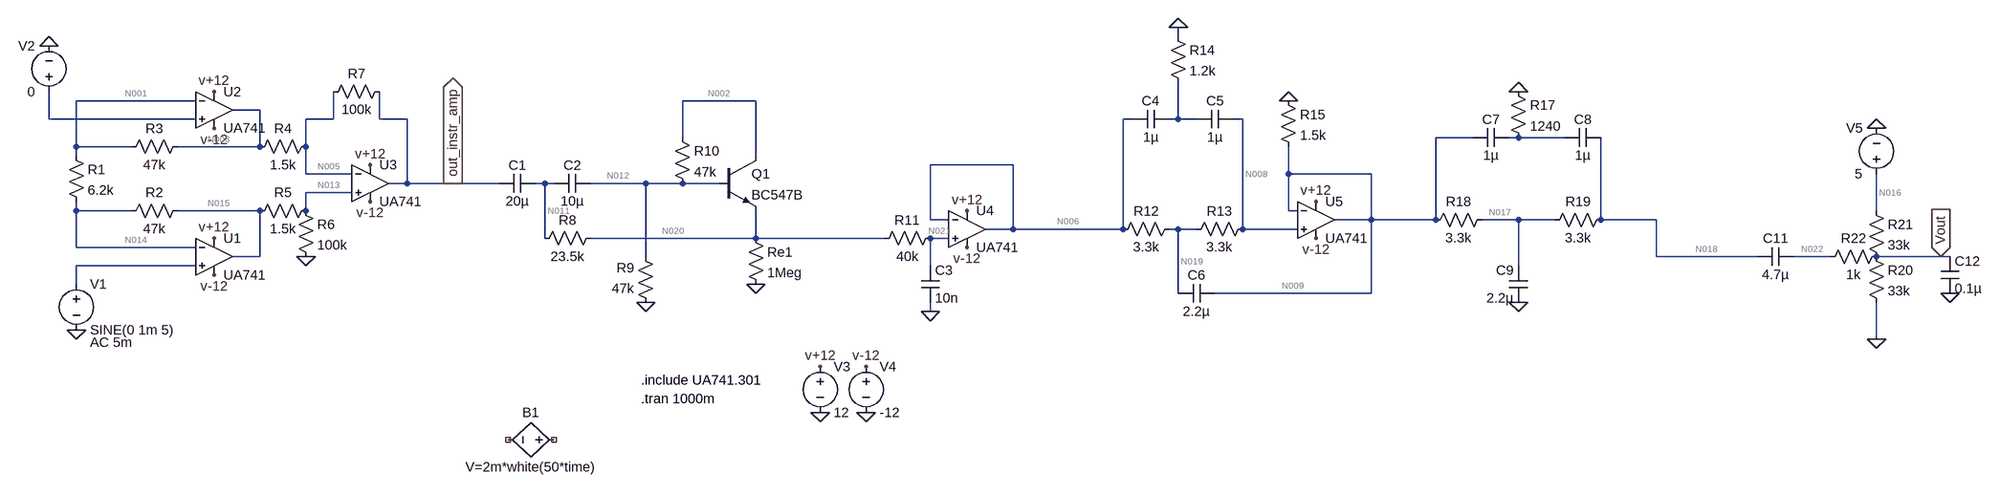
[diagram p0: schematic ECG.asc]
ECG.asc, the LTspice schematic file:
Version 4
SHEET 1 3316 1264
WIRE 1840 64 1840 48
WIRE 128 176 -80 176
WIRE 1104 176 976 176
WIRE 240 192 192 192
WIRE -128 208 -128 160
WIRE 128 208 -128 208
WIRE 368 208 368 160
WIRE 368 208 320 208
WIRE 448 208 448 160
WIRE 496 208 448 208
WIRE 1760 208 1744 208
WIRE 1840 208 1840 144
WIRE 1840 208 1824 208
WIRE 1872 208 1840 208
WIRE 1952 208 1936 208
WIRE 976 240 976 176
WIRE 2416 240 2352 240
WIRE 2496 240 2480 240
WIRE 2576 240 2496 240
WIRE -80 256 -80 176
WIRE 16 256 -80 256
WIRE 240 256 240 192
WIRE 240 256 96 256
WIRE 320 256 320 208
WIRE -80 272 -80 256
WIRE 1104 272 1104 176
WIRE 1552 288 1408 288
WIRE 320 304 320 256
WIRE 400 304 320 304
WIRE 2032 304 2032 256
WIRE 2176 304 2032 304
WIRE 496 320 496 208
WIRE 496 320 464 320
WIRE 576 320 496 320
WIRE 656 320 576 320
WIRE 736 320 720 320
WIRE 752 320 736 320
WIRE 912 320 816 320
WIRE 976 320 912 320
WIRE 1040 320 976 320
WIRE 400 336 320 336
WIRE -80 368 -80 352
WIRE 16 368 -80 368
WIRE 240 368 96 368
WIRE 320 368 320 336
WIRE 2032 368 2032 304
WIRE 2048 368 2032 368
WIRE 3120 368 3120 304
WIRE 1408 384 1408 288
WIRE 1440 384 1408 384
WIRE 2176 384 2176 304
WIRE 2176 384 2112 384
WIRE 2352 384 2352 240
WIRE 2352 384 2176 384
WIRE 2496 384 2432 384
WIRE 2560 384 2496 384
WIRE 2640 384 2640 240
WIRE 2736 384 2640 384
WIRE 1552 400 1552 288
WIRE 1552 400 1504 400
WIRE 1744 400 1744 208
WIRE 1744 400 1552 400
WIRE 1840 400 1824 400
WIRE 1872 400 1840 400
WIRE 1952 400 1952 208
WIRE 2048 400 1952 400
WIRE 736 416 736 320
WIRE 1104 416 1104 368
WIRE 1104 416 816 416
WIRE 1328 416 1104 416
WIRE 1440 416 1408 416
WIRE -80 432 -80 368
WIRE 128 432 -80 432
WIRE 240 448 240 368
WIRE 240 448 192 448
WIRE 912 448 912 320
WIRE 2736 448 2736 384
WIRE 2912 448 2736 448
WIRE 3040 448 2976 448
WIRE 3232 448 3120 448
WIRE 3248 448 3232 448
WIRE 128 464 -80 464
WIRE 1408 464 1408 416
WIRE 2496 464 2496 384
WIRE -80 496 -80 464
WIRE 1840 512 1840 400
WIRE 2176 512 2176 384
WIRE 2176 512 1904 512
WIRE 1408 544 1408 528
WIRE 3120 592 3120 528
FLAG -80 576 0
FLAG -128 80 0
FLAG 320 448 0
FLAG 912 528 0
FLAG 1104 496 0
FLAG 1408 544 0
FLAG 1840 48 0
FLAG 2032 176 0
FLAG 2496 160 0
FLAG 2496 528 0
FLAG 1216 720 0
FLAG 1296 720 0
FLAG 1216 640 v+12
FLAG 1296 640 v-12
FLAG 160 416 v+12
FLAG 160 160 v+12
FLAG 432 288 v+12
FLAG 1472 368 v+12
FLAG 2080 352 v+12
FLAG 160 480 v-12
FLAG 160 224 v-12
FLAG 432 352 v-12
FLAG 2080 416 v-12
FLAG 1472 432 v-12
FLAG 3120 224 0
FLAG 3120 592 0
FLAG 3248 512 0
FLAG 3232 448 Vout
IOPIN 3232 448 In
FLAG 576 320 out_instr_amp
IOPIN 576 320 Out
SYMBOL voltage -80 480 R0
WINDOW 123 24 118 Left 2
WINDOW 39 0 0 Left 0
SYMATTR Value2 AC 5m
SYMATTR InstName V1
SYMATTR Value SINE(0 1m 5)
SYMBOL opamp2 160 384 R0
SYMATTR InstName U1
SYMATTR Value UA741
SYMBOL res -96 256 R0
SYMATTR InstName R1
SYMATTR Value 6.2k
SYMBOL res 112 352 R90
WINDOW 0 0 56 VBottom 2
WINDOW 3 32 56 VTop 2
SYMATTR InstName R2
SYMATTR Value 47k
SYMBOL res 112 240 R90
WINDOW 0 0 56 VBottom 2
WINDOW 3 32 56 VTop 2
SYMATTR InstName R3
SYMATTR Value 47k
SYMBOL opamp2 160 128 R0
SYMATTR InstName U2
SYMATTR Value UA741
SYMBOL voltage -128 176 R180
WINDOW 0 24 96 Left 2
WINDOW 3 24 16 Left 2
SYMATTR InstName V2
SYMATTR Value 0
SYMBOL res 336 240 R90
WINDOW 0 0 56 VBottom 2
WINDOW 3 32 56 VTop 2
SYMATTR InstName R4
SYMATTR Value 1.5k
SYMBOL res 336 352 R90
WINDOW 0 0 56 VBottom 2
WINDOW 3 32 56 VTop 2
SYMATTR InstName R5
SYMATTR Value 1.5k
SYMBOL res 304 352 R0
SYMATTR InstName R6
SYMATTR Value 100k
SYMBOL opamp2 432 256 R0
SYMATTR InstName U3
SYMATTR Value UA741
SYMBOL res 464 144 R90
WINDOW 0 0 56 VBottom 2
WINDOW 3 32 56 VTop 2
SYMATTR InstName R7
SYMATTR Value 100k
SYMBOL cap 720 304 R90
WINDOW 0 0 32 VBottom 2
WINDOW 3 32 32 VTop 2
SYMATTR InstName C1
SYMATTR Value 20µ
SYMBOL cap 816 304 R90
WINDOW 0 0 32 VBottom 2
WINDOW 3 32 32 VTop 2
SYMATTR InstName C2
SYMATTR Value 10µ
SYMBOL res 832 400 R90
WINDOW 0 0 56 VBottom 2
WINDOW 3 32 56 VTop 2
SYMATTR InstName R8
SYMATTR Value 23.5k
SYMBOL res 928 544 R180
WINDOW 0 36 76 Left 2
WINDOW 3 36 40 Left 2
SYMATTR InstName R9
SYMATTR Value 47k
SYMBOL npn 1040 272 R0
SYMATTR InstName Q1
SYMATTR Value BC547B
SYMBOL res 1088 400 R0
SYMATTR InstName Re1
SYMATTR Value 1Meg
SYMBOL res 1424 400 R90
WINDOW 0 0 56 VBottom 2
WINDOW 3 32 56 VTop 2
SYMATTR InstName R11
SYMATTR Value 40k
SYMBOL opamp2 1472 336 R0
SYMATTR InstName U4
SYMATTR Value UA741
SYMBOL cap 1392 464 R0
SYMATTR InstName C3
SYMATTR Value 10n
SYMBOL res 960 224 R0
SYMATTR InstName R10
SYMATTR Value 47k
SYMBOL res 1840 384 R90
WINDOW 0 0 56 VBottom 2
WINDOW 3 32 56 VTop 2
SYMATTR InstName R12
SYMATTR Value 3.3k
SYMBOL res 1968 384 R90
WINDOW 0 0 56 VBottom 2
WINDOW 3 32 56 VTop 2
SYMATTR InstName R13
SYMATTR Value 3.3k
SYMBOL cap 1824 192 R90
WINDOW 0 0 32 VBottom 2
WINDOW 3 32 32 VTop 2
SYMATTR InstName C4
SYMATTR Value 1µ
SYMBOL cap 1936 192 R90
WINDOW 0 0 32 VBottom 2
WINDOW 3 32 32 VTop 2
SYMATTR InstName C5
SYMATTR Value 1µ
SYMBOL res 1824 48 R0
SYMATTR InstName R14
SYMATTR Value 1.2k
SYMBOL cap 1904 496 R90
WINDOW 0 0 32 VBottom 2
WINDOW 3 32 32 VTop 2
SYMATTR InstName C6
SYMATTR Value 2.2µ
SYMBOL opamp2 2080 320 R0
SYMATTR InstName U5
SYMATTR Value UA741
SYMBOL res 2016 160 R0
SYMATTR InstName R15
SYMATTR Value 1.5k
SYMBOL res 2480 144 R0
SYMATTR InstName R17
SYMATTR Value 1240
SYMBOL res 2448 368 R90
WINDOW 0 0 56 VBottom 2
WINDOW 3 32 56 VTop 2
SYMATTR InstName R18
SYMATTR Value 3.3k
SYMBOL res 2656 368 R90
WINDOW 0 0 56 VBottom 2
WINDOW 3 32 56 VTop 2
SYMATTR InstName R19
SYMATTR Value 3.3k
SYMBOL cap 2480 224 R90
WINDOW 0 0 32 VBottom 2
WINDOW 3 32 32 VTop 2
SYMATTR InstName C7
SYMATTR Value 1µ
SYMBOL cap 2640 224 R90
WINDOW 0 0 32 VBottom 2
WINDOW 3 32 32 VTop 2
SYMATTR InstName C8
SYMATTR Value 1µ
SYMBOL cap 2512 528 R180
WINDOW 0 24 56 Left 2
WINDOW 3 24 8 Left 2
SYMATTR InstName C9
SYMATTR Value 2.2µ
SYMBOL voltage 1216 624 R0
WINDOW 123 0 0 Left 0
WINDOW 39 0 0 Left 0
SYMATTR InstName V3
SYMATTR Value 12
SYMBOL voltage 1296 624 R0
WINDOW 123 0 0 Left 0
WINDOW 39 0 0 Left 0
SYMATTR InstName V4
SYMATTR Value -12
SYMBOL bv 768 768 R90
WINDOW 0 -32 56 VBottom 2
WINDOW 3 32 56 VTop 2
SYMATTR InstName B1
SYMATTR Value V=2m*white(50*time)
SYMBOL cap 2976 432 R90
WINDOW 0 0 32 VBottom 2
WINDOW 3 32 32 VTop 2
SYMATTR InstName C11
SYMATTR Value 4.7µ
SYMBOL res 3104 432 R0
SYMATTR InstName R20
SYMATTR Value 33k
SYMBOL res 3104 352 R0
SYMATTR InstName R21
SYMATTR Value 33k
SYMBOL res 3136 432 R90
WINDOW 0 0 56 VBottom 2
WINDOW 3 32 56 VTop 2
SYMATTR InstName R22
SYMATTR Value 1k
SYMBOL voltage 3120 320 R180
WINDOW 0 24 96 Left 2
WINDOW 3 24 16 Left 2
SYMATTR InstName V5
SYMATTR Value 5
SYMBOL cap 3232 448 R0
SYMATTR InstName C12
SYMATTR Value 0.1µ
TEXT 904 664 Left 2 !.include UA741.301
TEXT 904 696 Left 2 !.tran 1000m

The netlist it stands for:
* ECG.asc
V1 N023 0 SINE(0 1m 5) AC 5m
XU1 N023 N014 v+12 v-12 N015 UA741  ; pins In+ In- V+ V- OUT
R1 N001 N014 6.2k
R2 N015 N014 47k
R3 N003 N001 47k
XU2 N004 N001 v+12 v-12 N003 UA741  ; pins In+ In- V+ V- OUT
V2 N004 0 0
R4 N005 N003 1.5k
R5 N013 N015 1.5k
R6 N013 0 100k
XU3 N013 N005 v+12 v-12 out_instr_amp UA741  ; pins In+ In- V+ V- OUT
R7 out_instr_amp N005 100k
C1 N011 out_instr_amp 20µ
C2 N012 N011 10µ
R8 N020 N011 23.5k
R9 0 N012 47k
Q1 N002 N012 N020 0 BC547B
Re1 N020 0 1Meg
R11 N021 N020 40k
XU4 N021 N006 v+12 v-12 N006 UA741  ; pins In+ In- V+ V- OUT
C3 N021 0 10n
R10 N002 N012 47k
R12 N019 N006 3.3k
R13 N008 N019 3.3k
C4 N007 N006 1µ
C5 N008 N007 1µ
R14 0 N007 1.2k
C6 N009 N019 2.2µ
XU5 N008 N009 v+12 v-12 N009 UA741  ; pins In+ In- V+ V- OUT
R15 0 N009 1.5k
R17 0 N010 1240
R18 N017 N009 3.3k
R19 N018 N017 3.3k
C7 N010 N009 1µ
C8 N018 N010 1µ
C9 0 N017 2.2µ
V3 v+12 0 12
V4 v-12 0 -12
B1 NC_01 NC_02 V=2m*white(50*time)
C11 N022 N018 4.7µ
R20 Vout 0 33k
R21 N016 Vout 33k
R22 Vout N022 1k
V5 N016 0 5
C12 Vout 0 0.1µ
.model NPN NPN
.model PNP PNP
.lib standard.bjt
.include UA741.301
.tran 1000m
.backanno
.end

* Results of the author's LTspice run, read from the files saved beside the schematic
* Operating Point, zero values left out:
*   V(n015) = 3.76 mV
*   V(v-12) = -12 V
*   V(v+12) = 12 V
*   V(n014) = 11.17 µV
*   V(n001) = 11.17 µV
*   V(n003) = 3.76 mV
*   V(n005) = 3.598 mV
*   V(n013) = 3.587 mV
*   V(out_instr_amp) = 754.3 µV
*   V(n011) = -79.7 mV
*   V(n012) = -27.58 nV
*   V(n020) = -79.7 mV
*   V(n002) = -50.27 nV
*   V(n021) = -82.89 mV
*   V(n006) = -82.88 mV
*   V(n019) = -83.14 mV
*   V(n008) = -83.4 mV
*   V(n009) = -83.39 mV
*   V(n017) = -83.39 mV
*   V(n018) = -83.39 mV
*   V(n022) = 2.5 V
*   V(vout) = 2.5 V
*   V(n016) = 5 V
*   I(R2) = 79.76 nA
*   I(R3) = 79.76 nA
*   I(R4) = -108.2 nA
*   I(R5) = -115.6 nA
*   I(R6) = 35.87 nA
*   I(R7) = -28.43 nA
*   I(Re1) = -79.7 nA
*   I(R11) = -79.7 nA
*   I(R12) = -79.7 nA
*   I(R13) = -79.7 nA
*   I(R15) = 55.59 µA
*   I(R20) = 75.76 µA
*   I(R21) = 75.76 µA
*   I(V1) = -79.74 nA
*   I(V2) = -79.74 nA
*   I(V3) = -6.676 mA
*   I(V4) = 6.677 mA
*   I(V5) = -75.76 µA
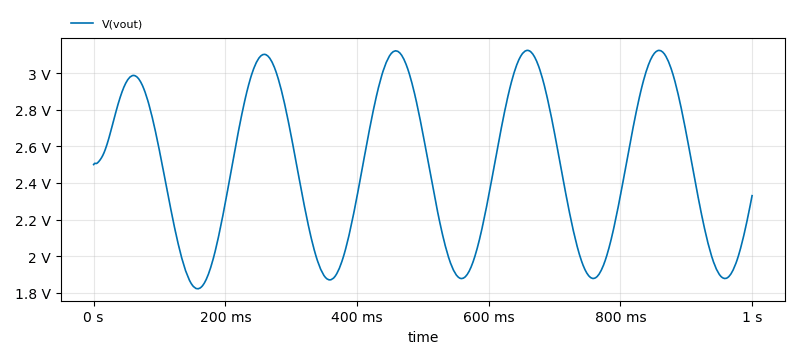
[diagram p1: Transient Analysis of ECG.asc, plotted from the saved traces]
* Transient Analysis, 1 run:
*   V(vout): min 1.822 V, max 3.124 V, average 2.481 V, rms 2.518 V, last 2.33 V